# EAGLE design ashield (EAGLE 5.11)
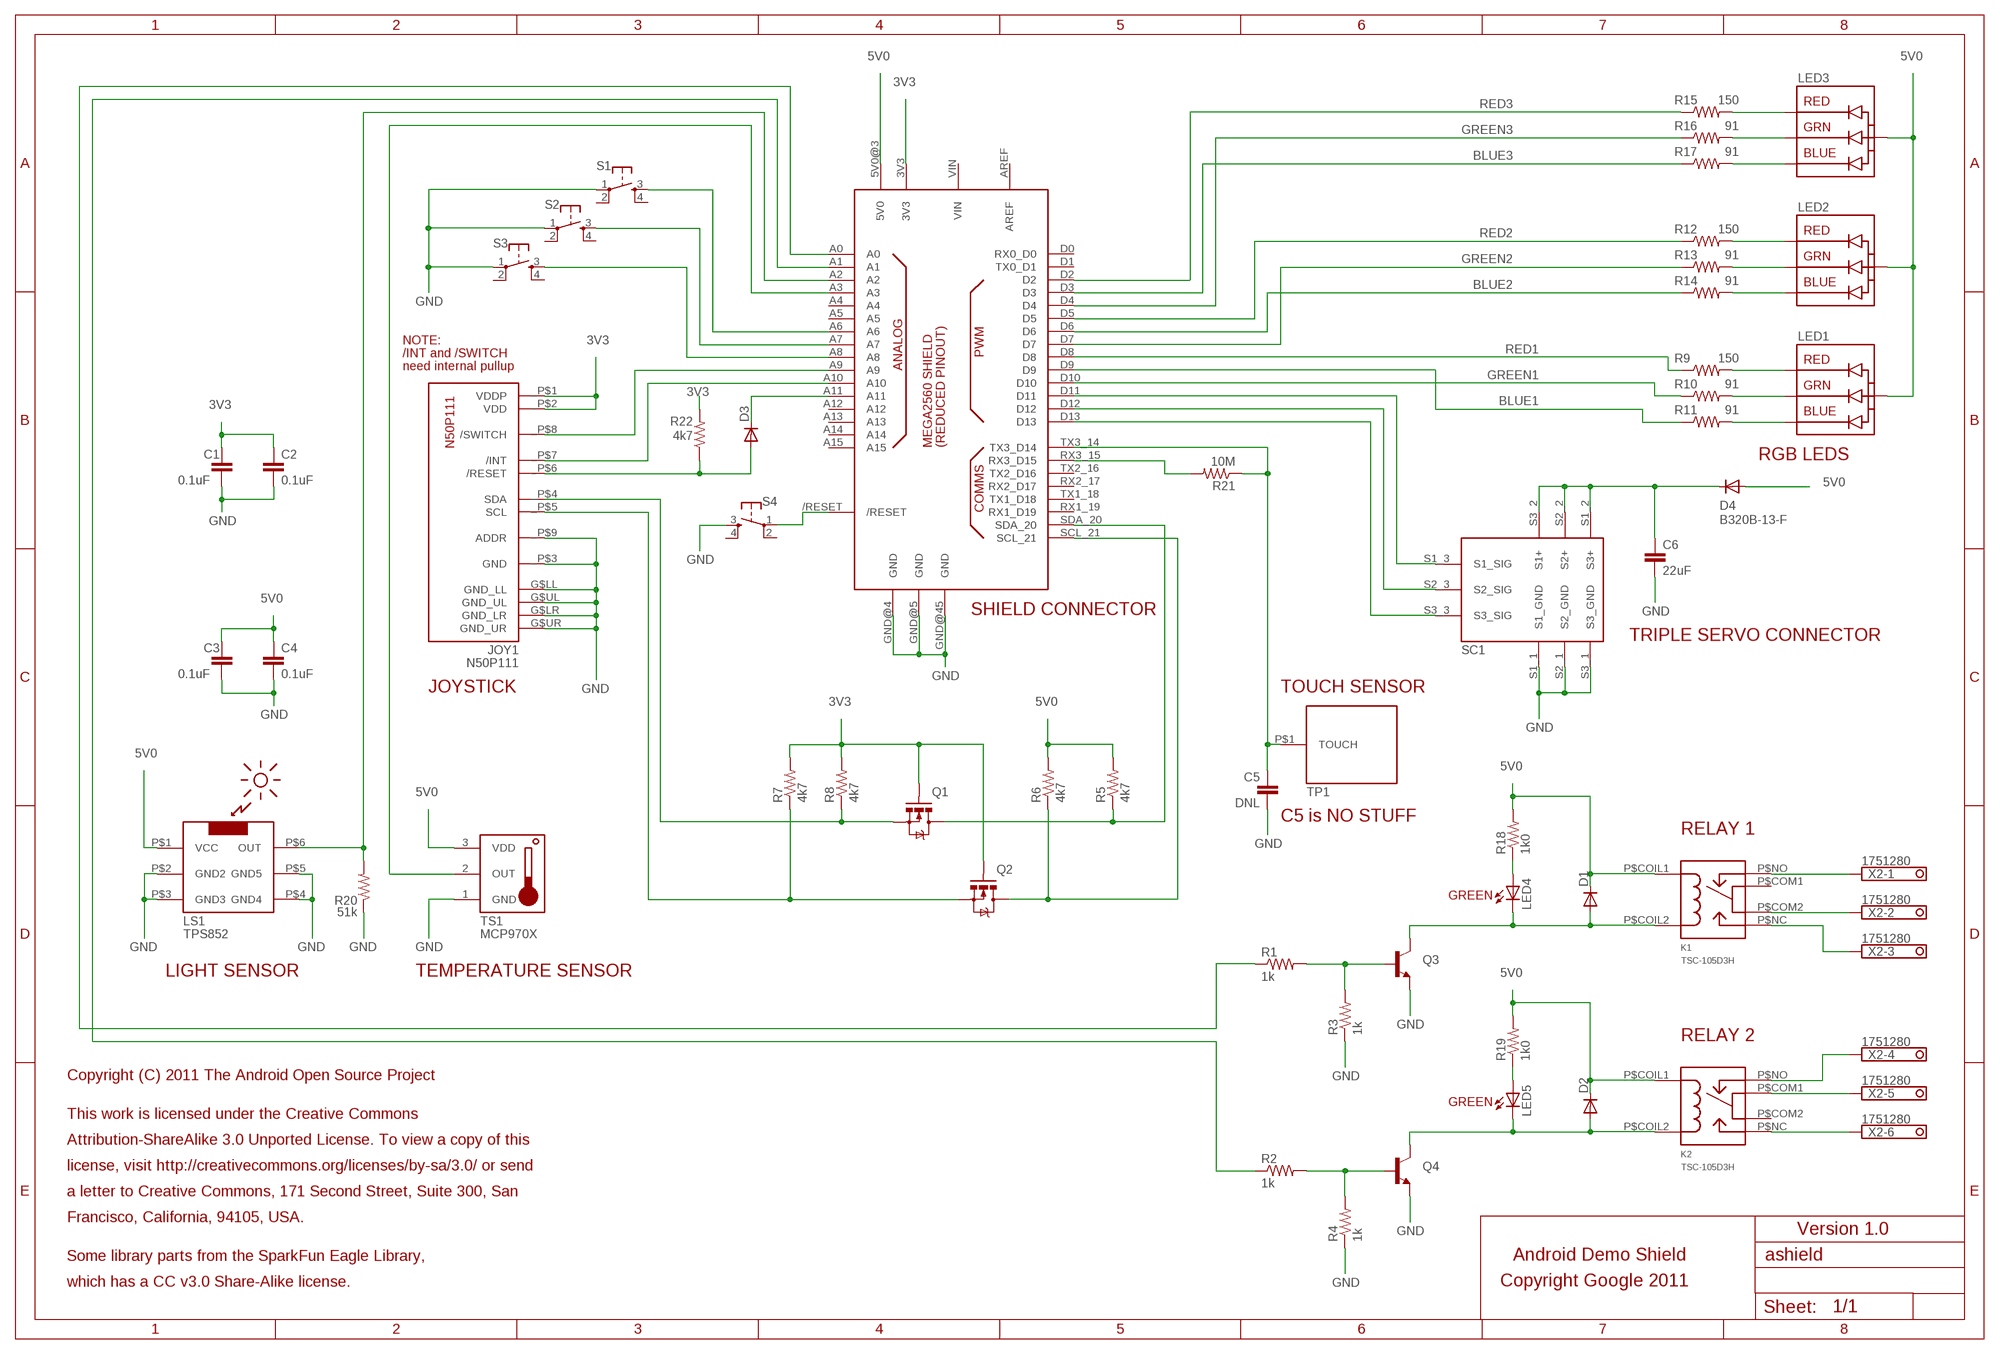
[diagram p0: schematic, sheet 1]

## Parts
BOARD1  MEGAARDUINO_REDUCED  [MEGA_ARDUINO_REDUCED]
C1  0.1uF  CAP0603-CAP  [0603-CAP]
C2  0.1uF  CAP0603-CAP  [0603-CAP]
C3  0.1uF  CAP0603-CAP  [0603-CAP]
C4  0.1uF  CAP0603-CAP  [0603-CAP]
C5  DNL  CAP0603-CAP  [0603-CAP]
C6  22uF  CAP1206  [1206]
D1  DIODESOD  [SOD-323]
D2  DIODESOD  [SOD-323]
D3  DIODESOD  [SOD-323]
D4  B320B-13-F  DIODESMA  [SMA-DIODE]
JOY1  N50P111  [N50P111]
K1  TSC-105D3H  [TSC-105D3H]
K2  TSC-105D3H  [TSC-105D3H]
LED1  SMD_RGB_LED4  [4SMD_LED]
LED2  SMD_RGB_LED4  [4SMD_LED]
LED3  SMD_RGB_LED4  [4SMD_LED]
LED4  LEDCHIPLED_0603  [CHIPLED_0603]
LED5  LEDCHIPLED_0603  [CHIPLED_0603]
LS1  TPS852  [TPS852]
Q1  MOSFET-NCHANNELSMD  [SOT23-3]
Q2  MOSFET-NCHANNELSMD  [SOT23-3]
Q3  TRANSISTOR_NPNSOT23-3  [SOT23-3]
Q4  TRANSISTOR_NPNSOT23-3  [SOT23-3]
R1  1k  RESISTOR0402-RES  [0402-RES]
R2  1k  RESISTOR0402-RES  [0402-RES]
R3  1k  RESISTOR0402-RES  [0402-RES]
R4  1k  RESISTOR0402-RES  [0402-RES]
R5  4k7  RESISTOR0402-RES  [0402-RES]
R6  4k7  RESISTOR0402-RES  [0402-RES]
R7  4k7  RESISTOR0402-RES  [0402-RES]
R8  4k7  RESISTOR0402-RES  [0402-RES]
R9  150  RESISTOR0402-RES  [0402-RES]
R10  91  RESISTOR0402-RES  [0402-RES]
R11  91  RESISTOR0402-RES  [0402-RES]
R12  150  RESISTOR0402-RES  [0402-RES]
R13  91  RESISTOR0402-RES  [0402-RES]
R14  91  RESISTOR0402-RES  [0402-RES]
R15  150  RESISTOR0402-RES  [0402-RES]
R16  91  RESISTOR0402-RES  [0402-RES]
R17  91  RESISTOR0402-RES  [0402-RES]
R18  1k0  RESISTOR0402-RES  [0402-RES]
R19  1k0  RESISTOR0402-RES  [0402-RES]
R20  51k  RESISTOR0402-RES  [0402-RES]
R21  10M  RESISTOR0402-RES  [0402-RES]
R22  4k7  RESISTOR0402-RES  [0402-RES]
S1  B3S-1000  [B3S-10XX]
S2  B3S-1000  [B3S-10XX]
S3  B3S-1000  [B3S-10XX]
S4  B3S-1000  [B3S-10XX]
SC1  3SERVOS  [3SERVOS]
TP1  ROBOT_TOUCHPADBARE  [ROBOT_50_TP_BARE]
TS1  MCP970X  [TO92]
X2  1751280  [1751280]

## Nets
3V3: BOARD1.3V3 C1.1 C2.1 JOY1._P$1(VDDP) JOY1._P$2(VDD) Q1.1(G) Q2.1(G) R7.2 R8.2 R22.2
5V0: BOARD1.5V0@3(5V0) C3.1 C4.1 D1.1(C) D2.1(C) D4.A K1.P$COIL1(COIL1) K2.P$COIL1(COIL1) LED1.P$2_CA(CA) LED2.P$2_CA(CA) LED3.P$2_CA(CA) LS1.P$1(VCC) R5.2 R6.2 R18.2 R19.2 TS1.3(VDD)
/JOYINT: BOARD1.A10 JOY1._P$7(/INT)
/JOYSWITCH: BOARD1.A9 JOY1._P$8(/SWITCH)
BLUE1: BOARD1.D9 R11.1
BLUE2: BOARD1.D6 R14.1
BLUE3: BOARD1.D3 R17.1
GND: BOARD1.GND@4(GND) BOARD1.GND@5(GND) BOARD1.GND@45(GND) C1.2 C2.2 C3.2 C4.2 C5.2 C6.2 JOY1._P$3(GND) JOY1._P$9(ADDR) JOY1.G$LL(GND_LL) JOY1.G$LR(GND_LR) JOY1.G$UL(GND_UL) JOY1.G$UR(GND_UR) LS1.P$2(GND2) LS1.P$3(GND3) LS1.P$4(GND4) LS1.P$5(GND5) Q3.2(E) Q4.2(E) R3.1 R4.1 R20.1 S1.1(P) S2.1(P) S3.1(P) S4.3(S) SC1.S1_1(S1_GND) SC1.S2_1(S2_GND) SC1.S3_1(S3_GND) TS1.1(GND)
GREEN1: BOARD1.D10 R10.1
GREEN2: BOARD1.D7 R13.1
GREEN3: BOARD1.D4 R16.1
K1_COM: K1.P$COM2(COM2) X2.2
K2_COM: K2.P$COM1(COM1) X2.5
LIGHT_VOLT: BOARD1.A2 LS1.P$6(OUT) R20.2
N$1: BOARD1./RESET S4.1(P)
N$2: LED3.P$3_BLUEK(BLUEK) R17.2
N$3: LED3.P$4_GREENK(GREENK) R16.2
N$4: LED3.P$1_REDK(REDK) R15.2
N$5: LED2.P$3_BLUEK(BLUEK) R14.2
N$6: LED2.P$4_GREENK(GREENK) R13.2
N$7: LED2.P$1_REDK(REDK) R12.2
N$8: LED1.P$1_REDK(REDK) R9.2
N$9: LED1.P$4_GREENK(GREENK) R10.2
N$10: LED1.P$3_BLUEK(BLUEK) R11.2
N$11: BOARD1.A6 S1.3(S)
N$12: BOARD1.A7 S2.3(S)
N$13: BOARD1.A8 S3.3(S)
N$14: BOARD1.RX3_15(RX3_D15) R21.2
N$15: D1.2(A) K1.P$COIL2(COIL2) LED4.C Q3.3(C)
N$16: D2.2(A) K2.P$COIL2(COIL2) LED5.C Q4.3(C)
N$17: BOARD1.TX3_14(TX3_D14) C5.1 R21.1 TP1.P$1(TOUCH)
N$18: C6.1 D4.C SC1.S1_2(S3+) SC1.S2_2(S2+) SC1.S3_2(S1+)
N$19: D3.2(A) JOY1._P$6(/RESET) R22.1
N$20: BOARD1.A11 D3.1(C)
N$21: K1.P$NO(NO) X2.1
N$22: K1.P$NC(NC) X2.3
N$23: K2.P$NC(NC) X2.6
N$24: K2.P$NO(NO) X2.4
N$25: Q3.1(B) R1.2 R3.2
N$26: Q4.1(B) R2.2 R4.2
N$29: LED4.A R18.1
N$30: LED5.A R19.1
RED1: BOARD1.D8 R9.1
RED2: BOARD1.D5 R12.1
RED3: BOARD1.D2 R15.1
RELAY1: BOARD1.A0 R1.1
RELAY2: BOARD1.A1 R2.1
SCL_3V3: JOY1._P$5(SCL) Q2.2(S) R7.1
SCL_5V: BOARD1.SCL_21 Q2.3(D) R6.1
SDA_3V3: JOY1._P$4(SDA) Q1.2(S) R8.1
SDA_5V: BOARD1.SDA_20 Q1.3(D) R5.1
SERVO1: BOARD1.D11 SC1.S1_3(S1_SIG)
SERVO2: BOARD1.D12 SC1.S2_3(S2_SIG)
SERVO3: BOARD1.D13 SC1.S3_3(S3_SIG)
TEMP_1WIRE: BOARD1.A3 TS1.2(OUT)
Unconnected: BOARD1.A4 BOARD1.A5 BOARD1.A12 BOARD1.A13 BOARD1.A14 BOARD1.A15 BOARD1.D0(RX0_D0) BOARD1.D1(TX0_D1) BOARD1.RX1_19(RX1_D19) BOARD1.RX2_17(RX2_D17) BOARD1.TX1_18(TX1_D18) BOARD1.TX2_16(TX2_D16) K1.P$COM1(COM1) K2.P$COM2(COM2) S1.2(P1) S1.4(S1) S2.2(P1) S2.4(S1) S3.2(P1) S3.4(S1) S4.2(P1) S4.4(S1)

## Notes on the sheet
- NOTE:
- /INT and /SWITCH
- need internal pullup
- RGB LEDS
- SHIELD CONNECTOR
- TRIPLE SERVO CONNECTOR
- JOYSTICK | TOUCH SENSOR
- C5 is NO STUFF
- RELAY 1
- GREEN
- LIGHT SENSOR | TEMPERATURE SENSOR
- RELAY 2
- Copyright (C) 2011 The Android Open Source Project
- GREEN
- This work is licensed under the Creative Commons
- Attribution-ShareAlike 3.0 Unported License. To view a copy of this
- license, visit http://creativecommons.org/licenses/by-sa/3.0/ or send
- a letter to Creative Commons, 171 Second Street, Suite 300, San
- Francisco, California, 94105, USA.
- Version 1.0
- Some library parts from the SparkFun Eagle Library, | Android Demo Shield
- which has a CC v3.0 Share-Alike license. | Copyright Google 2011

## Power pins joined to a net without a drawn wire
AREF: BOARD1.AREF
VIN: BOARD1.VIN

## Library data of the parts
BOARD1 = arduino:MEGAARDUINO_REDUCED
C1-C6 = SparkFun:CAP: Capacitor Standard 0603 ceramic capacitor, and 0.1" leaded capacitor.
D1-D4 = SparkFun:DIODE: Diode These are standard reverse protection diodes and small signal diodes. SMA package can handle up to about 1A. SOD-323 can handle about 200mA. What the SOD-323 package when ordering, there are some mfgs out there that are 5-pin packages.
JOY1 = AustriaMicro:N50P111
K1 K2 = Relay_Type:TSC-105D3H
LED1-LED3 = led-smd:SMD_RGB_LED4
LED4 LED5 = led:LED: LED OSRAM: - CHIPLED LG R971, LG N971, LY N971, LG Q971, LY Q971, LO R971, LY R971 LH N974, LH R974 LS Q976, LO Q976, LY Q976 LO Q996 - Hyper CHIPLED LW Q18S LB Q993, LB Q99A, LB R99A - SideLED LS A670, LO A670, LY A670, LG A670, LP A670 LB A673, LV A673, LT A673, LW A673 LH A674 LY A675 LS A676, LA A676, LO A676, LY A676, LW A676 LS A679, LY A679, LG A679 - Hyper Micro SIDELED® LS Y876, LA Y876, LO Y876, LY Y876 LT Y87S - SmartLED LW L88C, LW L88S LB L89C, LB L89S, LG L890 LS L89K, LO L89K, LY L89K LS L896, LA L896, LO L896, LY L896 - TOPLED LS T670, LO T670, LY T670, LG T670, LP T670 LSG T670, LSP T670, LSY T670, LOP T670, LYG T670 LG T671, LOG T671, LSG T671 LB T673, LV T673, LT T673, LW T673 LH T674 LS T676, LA T676, LO T676, LY T676, LB T676, LH T676, LSB T676, LW T676 LB T67C, LV T67C, LT T67C, LS T67K, LO T67K, LY T67K, LW E67C LS E67B, LA E67B, LO E67B, LY E67B, LB E67C, LV E67C, LT E67C LW T67C LS T679, LY T679, LG T679 LS T770, LO T770, LY T770, LG T770, LP T770 LB T773, LV T773, LT T773, LW T773 LH T774 LS E675, LA E675, LY E675, LS T675 LS T776, LA T776, LO T776, LY T776, LB T776 LHGB T686 LT T68C, LB T68C - Hyper Mini TOPLED® LB M676 - Mini TOPLED Santana® LG M470 LS M47K, LO M47K, LY M47K Source: http://www.osram.convergy.de LUXEON: - LUMILED® LXK2-PW12-R00, LXK2-PW12-S00, LXK2-PW14-U00, LXK2-PW14-V00 LXK2-PM12-R00, LXK2-PM12-S00, LXK2-PM14-U00 LXK2-PE12-Q00, LXK2-PE12-R00, LXK2-PE12-S00, LXK2-PE14-T00, LXK2-PE14-U00 LXK2-PB12-K00, LXK2-PB12-L00, LXK2-PB12-M00, LXK2-PB14-N00, LXK2-PB14-P00, LXK2-PB14-Q00 LXK2-PR12-L00, LXK2-PR12-M00, LXK2-PR14-Q00, LXK2-PR14-R00 LXK2-PD12-Q00, LXK2-PD12-R00, LXK2-PD12-S00 LXK2-PH12-R00, LXK2-PH12-S00 LXK2-PL12-P00, LXK2-PL12-Q00, LXK2-PL12-R00 Source: www.luxeon.com KINGBRIGHT: KA-3528ASYC Source: www.kingbright.com
LS1 = toshiba_light_sensor:TPS852
Q1 Q2 = SparkFun:MOSFET-NCHANNEL
Q3 Q4 = SparkFun:TRANSISTOR_NPN: Transistor NPN BJT configuration in SOT23 package. MMBT2222 is the common NPN we use. Double check BCE configuration again layout.
R1-R22 = SparkFun:RESISTOR: Resistor Basic schematic elements and footprints for 0603, 1206, and PTH 1/10th watt (small) resistors.
S1-S4 = switch-omron:B3S-1000: Omron Surface Mount Switch, 160g operating force, 4.3mm actuator height, sealed for immersion cleaning
SC1 = servocon:3SERVOS
TP1 = logos:ROBOT_TOUCHPAD
TS1 = microchip_temp:MCP970X
X2 = con-phoenix-350:1751280: MKDS 1/ 6-3,5 Printklemme Nennstrom: 10 A Bemessungsspannung: 160 V Raster: 3,5 mm Polzahl: 6 Montageart: Löten Anschlussart: Schraubanschluss Anschlussrichtung vom Leiter zur Platine: 0° Source: http://eshop.phoenixcontact.com .. 1751280.pdf; MPN: 1751280; OC_FARNELL: unknown; OC_NEWARK: 27R1765

## Board
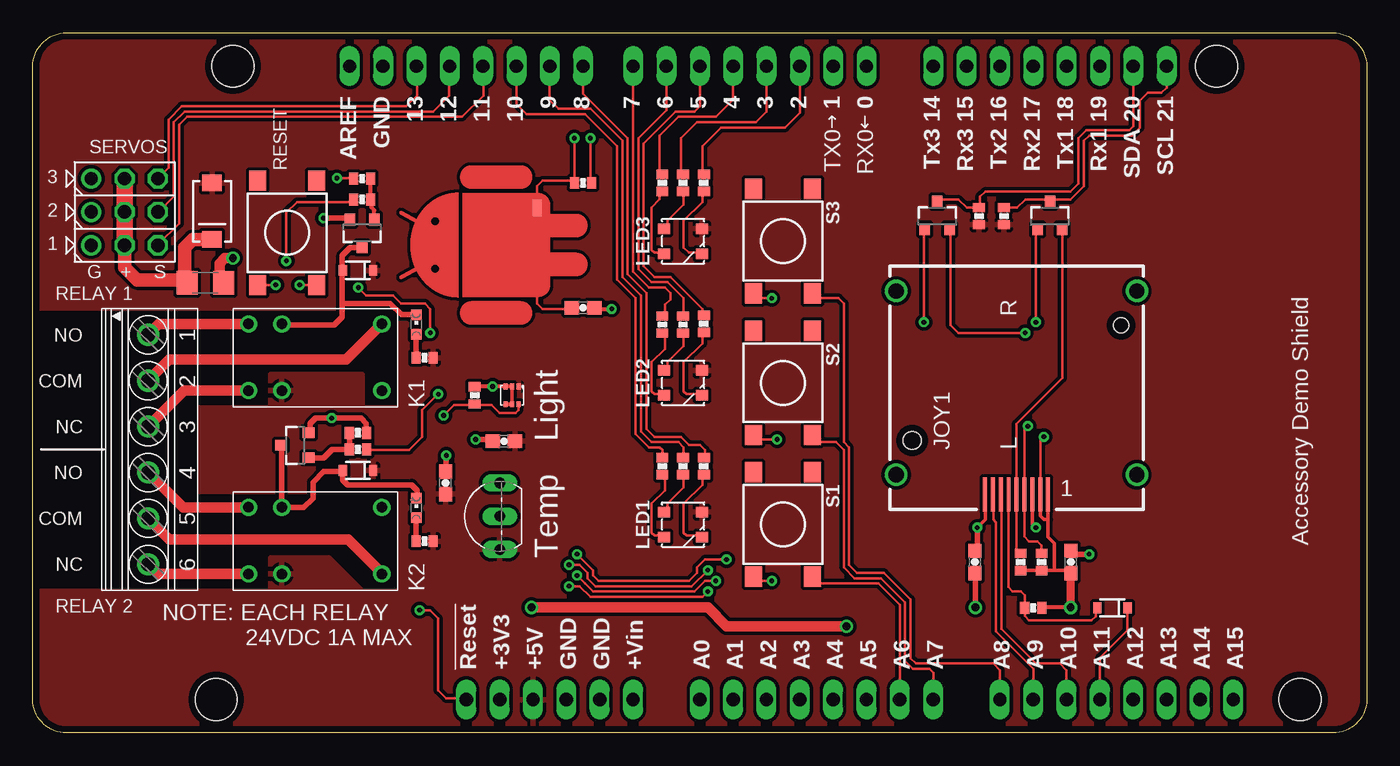
[diagram p1: board, top side]
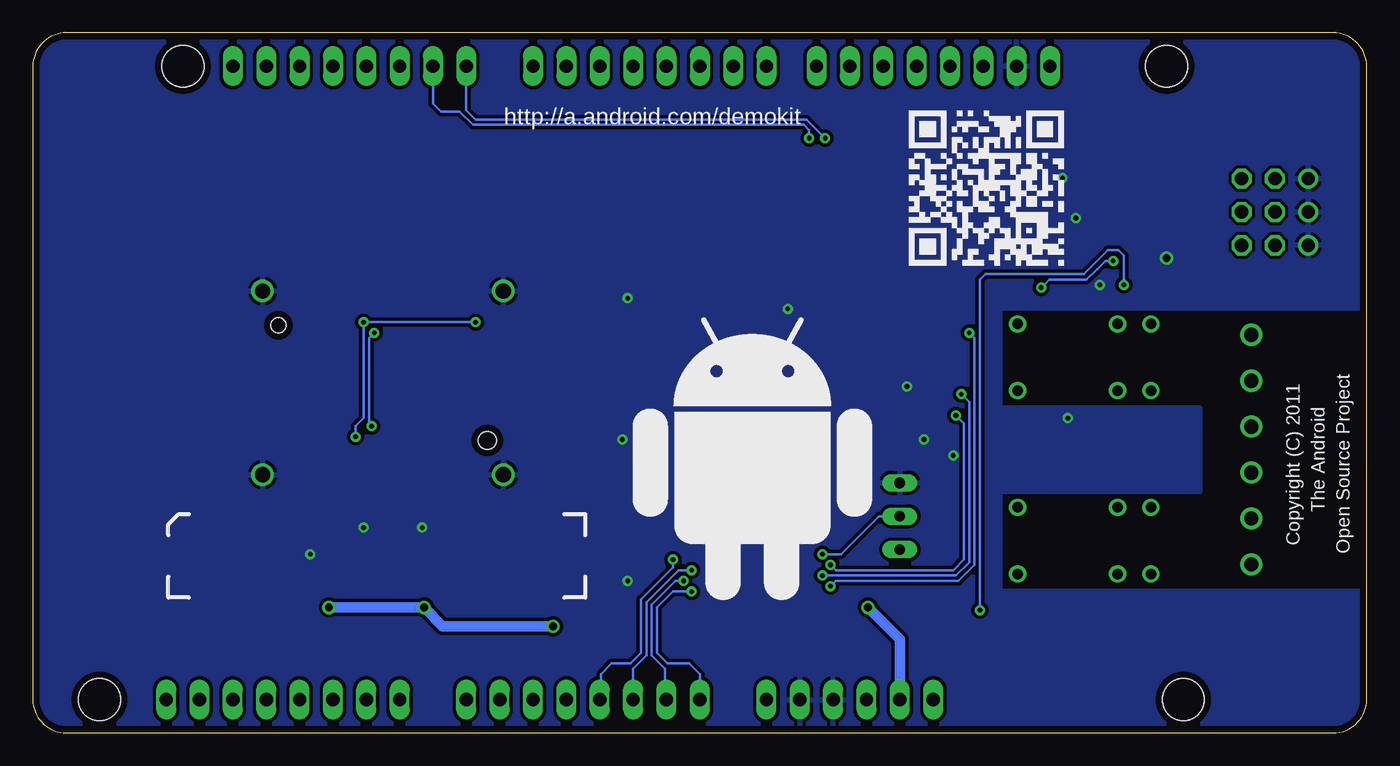
[diagram p2: board, bottom side, seen from below]

Size 101.6 x 53.34 mm. Coordinates in mm from the lower left corner, seen from the top.
Copper layers (1*16): Top 0.035mm / dielectric 1.5mm / Bottom 0.035mm
Design rules "default *": minimum track width 8mil, minimum drill 14mil, track to track 8mil, track to pad 8mil, pad to pad 8mil, via to via 8mil, smd to smd 8mil, copper to edge 20mil, drill to drill 8mil, minimum pad ring 10mil, minimum via ring 8mil, stop-mask expansion 4mil, vias tented up to drill 24mil, thermal gap 10mil

### Footprints (pad centres in the part's own frame; a part is rotated, then mirrored left to right if it is on the bottom)
MEGA_ARDUINO_REDUCED = drill 1.016 long: 3V3 35.56,2.54; 5V0@3 38.1,2.54; /RESET 33.02,2.54; A0 50.8,2.54; A1 53.34,2.54; A2 55.88,2.54; A3 58.42,2.54; A4 60.96,2.54; A5 63.5,2.54; A6 66.04,2.54; A7 68.58,2.54; A8 73.66,2.54; A9 76.2,2.54; A10 78.74,2.54; A11 81.28,2.54; A12 83.82,2.54; A13 86.36,2.54; A14 88.9,2.54; A15 91.44,2.54; AREF 24.13,50.8; D0 63.5,50.8; D1 60.96,50.8; D2 58.42,50.8; D3 55.88,50.8; D4 53.34,50.8; D5 50.8,50.8; D6 48.26,50.8; D7 45.72,50.8; D8 41.91,50.8; D9 39.37,50.8; D10 36.83,50.8; D11 34.29,50.8; D12 31.75,50.8; D13 29.21,50.8; GND@4 40.64,2.54; GND@5 43.18,2.54; GND@45 26.67,50.8; RX1_19 81.28,50.8; RX2_17 76.2,50.8; RX3_15 71.12,50.8; SCL_21 86.36,50.8; SDA_20 83.82,50.8; TX1_18 78.74,50.8; TX2_16 73.66,50.8; TX3_14 68.58,50.8; VIN 45.72,2.54 | hole 3.2: 15.24,50.8; 13.97,2.54; 90.17,50.8; 96.52,2.54
0603-CAP = smd 1.1 x 1: 1 -0.85,0; 2 0.85,0
1206 = smd 1.6 x 1.8: 1 -1.4,0; 2 1.4,0
SOD-323 = smd 0.63 x 0.83: 1 -1.15,0; 2 1.15,0
SMA-DIODE = smd 1.27 x 1.47: A -2.15,0; C 2.15,0
N50P111 = smd 0.3 x 2.6: _P$1 2.4,-8.5; _P$2 1.8,-8.5; _P$3 1.2,-8.5; _P$4 0.6,-8.5; _P$5 0,-8.5; _P$6 -0.6,-8.5; _P$7 -1.2,-8.5; _P$8 -1.8,-8.5; _P$9 -2.4,-8.5 | drill 1.15 round: G$LL 9.17,-7; G$LR 9.17,7; G$UL -9.17,-7; G$UR -9.17,7 | hole 1.15: 7.95,4.4 | hole 1.35: -7.95,-4.4
TSC-105D3H = drill 0.8 round: P$COIL1 -2.5,2.62; P$COIL2 2.58,2.62; P$COM1 -2.5,-5; P$COM2 2.58,-5; P$NC -2.5,5.16; P$NO 2.58,5.16
4SMD_LED = smd 0.8 x 0.9: P$1_REDK -0.95,-1.45; P$2_CA 0.95,-1.45; P$3_BLUEK 0.95,1.45; P$4_GREENK -0.95,1.45
CHIPLED_0603 = smd 0.8 x 0.8: A 0,-0.75; C 0,0.75
TPS852 = smd 0.3 x 0.45: P$1 -0.5,-0.675; P$2 0,-0.675; P$3 0.5,-0.675; P$4 0.5,0.675; P$5 0,0.675; P$6 -0.5,0.675
SOT23-3 = smd 0.8 x 0.9: 1 -0.95,-1; 2 0.95,-1; 3 0,1.1
0402-RES = smd 0.7 x 0.9: 1 -0.65,0; 2 0.65,0
B3S-10XX = smd 1.55 x 1.3: 1 3.975,-2.25; 2 -3.975,-2.25; 3 3.975,2.25; 4 -3.975,2.25
3SERVOS = drill 1.016 round: S1_1 -2.54,-2.54; S2_1 -2.54,0; S3_1 -2.54,2.54 | drill 1.016 octagon: S1_2 0,-2.54; S1_3 2.54,-2.54; S2_2 0,0; S2_3 2.54,0; S3_2 0,2.54; S3_3 2.54,2.54
ROBOT_50_TP_BARE = smd 1.27 x 0.635: P$1 8.89,3.81
TO92 = drill 0.813 long: 1 2.54,0; 2 0,0; 3 -2.54,0
1751280 = drill 1.1 pad 1.7 round: 1 -8.75,-0.1; 2 -5.25,-0.1; 3 -1.75,-0.1; 4 1.75,-0.1; 5 5.25,-0.1; 6 8.75,-0.1

### Placement (x,y rotation side)
BOARD1  0,0 0 top
C1  71.75,13.02 90 top
C2  79.06,13.02 90 top
C3  31.43,19.05 90 top
C4  35.88,22.23 180 top
C5  41.91,32.38 0 top
C6  13.14,34.29 0 top
D1  24.77,35.24 180 top
D2  24.77,20 180 top
D3  82.23,9.53 180 top
D4  13.65,39.75 270 top
JOY1  74.93,26.67 0 top
K1  21.59,28.57 90 top
K2  21.59,14.61 90 top
LED1  49.53,15.88 90 top
LED2  49.53,26.67 90 top
LED3  49.53,37.47 90 top
LED4  29.21,31.11 0 top
LED5  29.21,17.14 0 top
LS1  36.51,25.72 180 top
Q1  68.9,39.37 0 top
Q2  77.47,39.37 0 top
Q3  25.08,38.1 180 top
Q4  20,21.91 90 top
R1  25.08,40.64 0 top
R2  24.77,21.59 180 top
R3  25.08,42.23 0 top
R4  24.77,22.86 180 top
R5  72.07,39.37 270 top
R6  73.98,39.37 270 top
R7  75.25,13.02 270 top
R8  76.83,13.02 270 top
R9  51.12,20.32 270 top
R10  47.94,20.32 270 top
R11  49.53,20.32 270 top
R12  51.12,31.17 270 top
R13  47.94,31.11 270 top
R14  49.53,31.11 270 top
R15  51.12,41.91 270 top
R16  47.94,41.91 270 top
R17  49.53,41.91 270 top
R18  29.84,28.57 0 top
R19  29.84,14.61 0 top
R20  33.66,25.72 270 top
R21  41.91,41.91 0 top
R22  76.2,9.53 0 top
S1  57.15,15.88 270 top
S2  57.15,26.67 270 top
S3  57.15,37.47 270 top
S4  19.37,38.1 270 top
SC1  6.99,39.69 0 top
TP1  42.24,31.11 90 top
TS1  35.56,16.51 90 top
U$2  [QR_AAA_FINAL]  35.24,35.24 0 bottom
U$9  [ROBOT_75]  55.88,10.16 0 bottom
X2  8.89,21.59 270 top

### Tracks (layer width: path | path; a pad name or v marks a point on that pad's centre or on a via)
3V3  (via drill 0.36, 0.6)
  Top 0.203: Q1.1 67.87,38.29 v67.87,31.29 | v76.4,31.29 76.4,38.37 Q2.1 | JOY1._P$2 76.73,22.23 v77.01,22.55
  Top 0.254: R7.2 R8.2 77.83,12.37 | 77.83,12.37 78.88,12.37 C2.1 | 77.83,12.37 77.83,14.43 77.33,14.92 77.33,16.26 | 77.33,16.26 JOY1._P$1 | 77.33,16.26 77.01,16.26 76.73,16.54 JOY1._P$2 | Q2.1 76.73,38.16
  Top 0.305: R22.2 76.88,9.55 v79.05,9.55
  Top 0.406: C1.1 71.81,12.12 v71.81,9.55
  Top 0.61: v79.05,9.55 79.06,9.56 C2.1
  Top 0.813: v38,9.55 51.41,9.55 52.83,8.13 v61.98,8.13
  Bottom 0.203: v67.87,31.29 v76.4,31.29 76.4,23.98 77.01,23.37 v77.01,22.55
  Bottom 0.813: BOARD1.3V3 35.56,7.11 v38,9.55 | v61.98,8.13 70.38,8.13 v71.81,9.55 v79.05,9.55
5V0
  pour Top (isolate 0.254): 0,0 0,10.79 18.1,10.79 18.1,13.34 22.54,13.34 25.08,10.79 27.94,10.79 27.94,18.41 12.7,18.41 12.7,24.77 18.1,24.77 18.1,27.3 25.08,27.3 25.08,24.77 27.94,24.77 27.94,32.38 0,32.38 0,53.34 101.6,53.34 101.6,0
/JOYINT
  Top 0.203: JOY1._P$7 73.76,18.14 73.76,7.92 76.4,5.28 78.23,5.28 78.74,4.78 BOARD1.A10
/JOYSWITCH
  Top 0.203: JOY1._P$8 73.15,18.15 73.15,16.26 73.36,16.05 73.36,7.72 76.2,4.88 BOARD1.A9
BLUE1
  Top 0.203: BOARD1.D9 39.37,48.21 40.03,47.55 42.47,47.55 44.91,45.11 44.91,34.75 46.33,33.33 46.33,22.96 47.14,22.15 49.17,22.15 49.58,21.74 49.58,21.11 R11.1
BLUE2
  Top 0.203: BOARD1.D6 48.26,47.45 46.13,45.31 46.13,35.36 47.14,34.34 48.36,34.34 49.58,33.12 49.58,31.5 R14.1
BLUE3
  Top 0.203: BOARD1.D3 55.88,47.35 55.07,46.53 50.6,46.53 49.38,45.31 49.38,42.7 R17.1
GND  (via drill 0.36, 0.6)
  Top 0.203: S3.1 55.27,33.12 v56.29,33.12 | S2.1 55.24,22.35 v56.69,22.35 | S1.1 55.22,11.58 v56.29,11.58 | C5.2 42.84,32.31 | R3.1 24.25,42.27 v23.16,42.27 | v20.32,34.14 20.97,34.14 arc-90 S4.3
  Top 0.254: LS1.P$5 LS1.P$2 | JOY1._P$3 76.13,15.92 v76.4,15.65 | JOY1._P$9 72.54,18.16 72.54,16.26 v71.93,15.65
  Top 0.305: LS1.P$2 LS1.P$3 v35.01,26.39 33.68,26.39 R20.1 | LS1.P$4 LS1.P$5 | 42.84,32.31 v44.09,32.31
  Top 0.406: Q4.2 21.13,22.99 21.13,23.57 21.54,23.98 v22.76,23.98 24.99,23.98 25.4,23.57 25.4,22.88 R4.1 | C1.2 71.93,14.04 v71.93,15.65 | v80.47,13.61 79.06,13.61 C2.2 | C3.2 31.5,19.9 v31.5,21.13 | C4.2 34.9,22.35 v33.73,22.35 | Q3.2 24.08,39.22 v22.15,39.22
  Top 0.61: C6.2 14.22,34.29
  Top 0.813: v15.24,36.17 14.63,36.17 14.22,35.76 14.22,34.29
  pour Bottom (isolate 0.254): 0,0 0,10.79 27.94,10.79 27.94,18.41 12.7,18.41 12.7,24.77 27.94,24.77 27.94,32.38 27.3,32.38 0,32.38 0,53.34 101.6,53.34 101.6,0
GREEN1
  Top 0.203: BOARD1.D10 36.83,47.9 37.59,47.14 42.06,47.14 44.5,44.7 44.5,34.54 45.92,33.12 45.92,22.76 46.94,21.74 47.75,21.74 47.95,21.54 47.96,20.93 R10.1
GREEN2
  Top 0.203: BOARD1.D7 45.72,35.15 46.94,33.93 48.16,33.93 48.56,33.53 48.56,33.03 48.16,32.63 48.16,31.78 R13.1
GREEN3
  Top 0.203: BOARD1.D4 53.34,48.26 52.02,46.94 49.17,46.94 47.75,45.52 47.75,42.57 R16.1
K1_COM
  Top 0.813: X2.2 10.4,28.45 23.88,28.45 K1.P$COM2
K2_COM
  Top 0.813: X2.5 10.4,14.73 24,14.73 26.59,12.14 K2.P$COM1
LIGHT_VOLT  (via drill 0.36)
  Top 0.203: 37.04,24.95 LS1.P$6 36.98,25.01 36.98,24.59 36.78,24.38 35.56,24.38 34.95,24.99 33.73,24.99 R20.2 33.58,24.99 32.11,24.99 v31.29,24.18 | v51.41,12.39 50.19,11.18 42.88,11.18 42.27,11.79 42.27,12.19 41.66,12.8 v40.84,12.8
  Bottom 0.203: v51.41,12.39 52.43,12.39 54.86,9.96 54.86,5.89 55.88,4.88 BOARD1.A2 | v40.84,12.8 40.44,12.39 31.5,12.39 30.68,13.21 30.68,23.57 v31.29,24.18
N$1  (via drill 0.36)
  Top 0.203: v29.46,9.35 30.28,9.35 30.89,8.74 30.89,3.25 31.5,2.64 32.92,2.64 BOARD1./RESET | v18.49,34.14 18.07,34.12 S4.1
  Bottom 0.203: v29.46,9.35 29.46,34.54 29.06,34.95 21.54,34.95 19.71,36.78 18.9,36.78 18.49,36.37 v18.49,34.14
N$2
  Top 0.203: R17.2 49.58,40.99 49.58,40.23 48.36,39.01 48.36,38.54 LED3.P$3_BLUEK
N$3
  Top 0.203: R16.2 47.75,41.05 47.75,40.66 47.14,40.03 47.14,36.78 47.35,36.58 48.02,36.58 LED3.P$4_GREENK
N$4
  Top 0.203: LED3.P$1_REDK 50.84,36.58 49.99,36.58 49.58,36.98 49.58,39.01 51,40.44 51,41.15 R15.2
N$5
  Top 0.203: LED2.P$3_BLUEK 48.36,27.9 48.36,28.25 49.58,29.46 49.58,30.1 R14.2
N$6
  Top 0.203: R13.2 48.16,30.43 48.16,29.26 47.14,28.25 47.14,26.01 47.35,25.81 47.99,25.81 LED2.P$4_GREENK
N$7
  Top 0.203: R12.2 51,30.38 51,29.67 49.58,28.25 49.58,26.01 49.78,25.81 50.89,25.81 LED2.P$1_REDK
N$8
  Top 0.203: R9.2 51,19.33 51,18.9 49.58,17.48 49.58,15.24 49.78,15.04 50.87,15.04 LED1.P$1_REDK
N$9
  Top 0.203: R10.2 48.16,19.45 48.16,18.49 47.14,17.48 47.14,15.24 47.35,15.04 47.99,15.04 LED1.P$4_GREENK
N$10
  Top 0.203: LED1.P$3_BLUEK 48.36,17.11 48.36,17.48 49.58,18.69 49.58,19.62 R11.2
N$11
  Top 0.203: S1.3 59.92,11.38 64.41,11.38 66.04,9.75 BOARD1.A6
N$12
  Top 0.203: S2.3 59.95,22.15 61.16,22.15 61.77,21.54 61.77,12.6 62.59,11.79 64.62,11.79 66.45,9.96 66.45,5.49 67.06,4.88 68.28,4.88 68.58,4.57 BOARD1.A7
N$13
  Top 0.203: S3.3 59.77,33.12 61.37,33.12 61.77,32.72 61.77,22.15 62.18,21.74 62.18,12.8 62.79,12.19 64.82,12.19 66.85,10.16 66.85,5.69 67.26,5.28 73.15,5.28 73.66,4.78 BOARD1.A8
N$14  (via drill 0.36)
  Top 0.203: R21.2 42.47,42 v42.47,45.31
  Bottom 0.203: v42.47,45.31 42.47,45.92 42.88,46.33 68.07,46.33 69.09,47.35 70.51,47.35 71.12,47.95 BOARD1.RX3_15
N$15
  Top 0.406: K1.P$COIL2 19.04,31.09 22.96,31.09 23.57,31.7 23.57,32.72 | LED4.C 28.08,31.86 27.23,32.72 23.57,32.72 | Q3.3 24.93,36.98 24.18,36.98 23.57,36.37 23.57,35.34 D1.2 23.57,35.15 23.57,32.72
N$16
  Top 0.406: Q4.3 18.97,21.84 K2.P$COIL2 20.64,17.18 21.34,17.88 21.34,19.1 22.15,19.91 23.53,19.91 D2.2 23.61,19.26 23.98,18.9 28.85,18.9 29.26,18.49 29.26,17.95 LED5.C
N$17  (via drill 0.36)
  Top 0.203: C5.1 40.98,32.31 38.81,32.31 38.41,32.72 38.41,40.01 TP1.P$1 38.41,40.03 38.41,41.66 38.81,42.06 41.11,42.06 R21.1 v41.26,45.3 v41.25,45.31
  Bottom 0.203: v41.25,45.31 42.67,46.74 67.87,46.74 68.58,47.45 BOARD1.TX3_14
N$18
  Top 1.016: SC1.S2_2 6.99,35.47 7.94,34.52 11.2,34.52 | 11.2,34.52 C6.1 | 11.2,34.52 11.56,34.52 11.58,34.54 11.58,36.98 12.19,37.59 13.33,37.59 D4.C
  Top 1.27: SC1.S3_2 SC1.S2_2 SC1.S1_2
N$19
  Top 0.203: D3.2 80.96,9.4 80.96,8.89 80.64,8.57 75.88,8.57 75.55,8.9 R22.1 75.56,9.54 75.56,10.48 75.25,10.79 74.61,10.79 74.3,11.11 74.3,18.14 JOY1._P$6
N$20
  Top 0.203: BOARD1.A11 81.28,5.71 83.38,7.82 D3.1
N$21
  Top 0.813: K1.P$NO 9.61,31.16 X2.1
N$22
  Top 0.813: K1.P$NC 11.53,26.07 X2.3
N$23
  Top 0.813: K2.P$NC 9.53,12.11 X2.6
N$24
  Top 0.813: K2.P$NO 11.45,17.18 X2.4
N$25
  Top 0.305: Q3.1 26.01,39.19 26.01,39.83 25.8,40.04 25.8,40.43 R1.2 R3.2
N$26
  Top 0.406: R4.2 R2.2 22.81,21.59 22.15,20.93 21.03,20.93 Q4.1
N$29
  Top 0.203: 29.2,30.35 LED4.A
  Top 0.406: R18.1 29.2,30.35
N$30
  Top 0.203: 29.2,16.38 LED5.A
  Top 0.406: R19.1 29.2,16.38
RED1
  Top 0.203: BOARD1.D8 41.91,48.72 45.31,45.31 45.31,34.95 46.74,33.53 46.74,23.16 47.35,22.55 49.38,22.55 49.99,21.95 50.8,21.95 51.21,21.54 51.21,20.83 R9.1
RED2
  Top 0.203: BOARD1.D5 50.8,47.75 50.39,47.35 48.97,47.35 46.53,44.91 46.53,35.56 47.35,34.75 48.56,34.75 51,32.31 51,31.52 R12.1
RED3
  Top 0.203: BOARD1.D2 58.42,47.24 57.3,46.13 52.43,46.13 51,44.7 51,42.67 R15.1
RELAY1  (via drill 0.36)
  Top 0.203: v40.84,11.18 41.66,11.18 42.47,10.36 51,10.36 v51.41,10.77 | v30.28,30.48 30.28,32.31 29.87,32.72 28.04,32.72 27.43,33.33 25.4,33.33 v24.79,33.93 | R1.1 24.29,40.44 20.12,40.44 19.3,39.62 v19.3,35.97
  Bottom 0.203: BOARD1.A0 50.8,4.47 51.61,5.28 53.24,5.28 54.05,6.1 54.05,9.55 52.83,10.77 v51.41,10.77 | v40.84,11.18 40.44,11.58 31.09,11.58 29.87,12.8 29.87,30.07 v30.28,30.48 | v19.3,35.97 19.91,35.97 20.52,35.36 21.34,34.54 24.18,34.54 v24.79,33.93
RELAY2  (via drill 0.36)
  Top 0.203: R2.1 25.47,21.54 28.65,21.54 29.67,22.55 29.67,24.59 v30.89,25.81 | v41.45,11.99 42.06,11.38 42.67,10.77 50.39,10.77 51.21,11.58 v52.02,11.58
  Bottom 0.203: v30.89,25.81 30.28,25.2 30.28,13.01 31.29,11.99 v41.45,11.99 | v52.02,11.58 52.63,11.58 54.46,9.75 54.46,5.89 53.44,4.88 53.44,2.64 BOARD1.A1
SCL_3V3
  Top 0.203: R7.1 74.93,13.98 JOY1._P$5 74.93,23.52 78.44,27.03 78.44,38.35 Q2.2
SCL_5V
  Top 0.203: BOARD1.SCL_21 86.36,49.17 85.95,48.77 84.94,48.77 84.33,48.16 84.33,46.13 83.72,45.52 80.47,45.52 80.06,45.11 80.06,41.66 79.05,40.64 77.64,40.64 Q2.3 77.3,40.64 75.59,40.64 74.97,40.02 R6.1
SDA_3V3  (via drill 0.36)
  Top 0.203: R8.1 76.83,14.29 76.52,14.61 75.88,14.61 75.53,14.96 JOY1._P$4 75.53,23.1 v75.79,23.37 | v75.59,30.48 70.51,30.48 69.9,31.09 69.9,38.32 Q1.2
  Bottom 0.203: v75.79,23.37 76,23.57 76,30.07 v75.59,30.48
SDA_5V
  Top 0.203: Q1.3 69.07,40.64 70.51,40.64 71.13,40.02 R5.1 72.14,40.08 72.14,40.84 72.54,41.25 79.05,41.25 79.65,41.86 79.65,45.31 80.26,45.92 83.52,45.92 83.82,46.23 BOARD1.SDA_20
SERVO1
  Top 0.203: SC1.S1_3 9.53,37.19 11.15,38.81 11.15,46.33 11.76,46.94 32.72,46.94 34.34,48.56 34.34,50.75 BOARD1.D11
SERVO2
  Top 0.203: SC1.S2_3 9.59,39.69 10.74,40.84 10.74,46.53 11.56,47.35 30.48,47.35 31.7,48.56 31.7,50.75 BOARD1.D12
SERVO3
  Top 0.203: BOARD1.D13 29.26,50.75 29.26,48.56 28.45,47.75 11.35,47.75 10.34,46.74 10.34,43.08 9.53,42.27 SC1.S3_3
TEMP_1WIRE  (via drill 0.36)
  Top 0.203: v41.45,13.61 42.67,12.39 42.67,11.99 43.08,11.58 49.99,11.58 50.6,12.19 50.6,12.6 51.21,13.21 v52.83,13.21
  Bottom 0.203: v52.83,13.21 52.83,12.6 55.27,10.16 55.27,6.1 56.08,5.28 57.51,5.28 58.32,4.47 58.32,2.64 BOARD1.A3 | v41.45,13.61 40.03,13.61 37.13,16.51 TS1.2

### Text on the board
Dimension: ASHIELD Board | Release v1.0, March 28, 2011 | Copyright Google, Inc. 2011 | Route 0-mil perimeter in top silk | .062" FR4 | 1 oz Cu | RoHS | HASL | VENDOR MARK AND TEST STAMP SHOULD | NOTE: | BE PLACED WITHIN JOY1 RECTANGLE | OTHER NOTES: | Board is WHITE SMOBC | ashield_blk.plc | BLACK primary (first) layer silk, component side | ashield_blk.pls | BLACK silk, solder side
tPlace: SERVOS | 3 | RESET | 2 | 1 | RELAY 1 | NO | COM | NC | Light | NO | COM | Accessory Demo Shield | NC | Temp | RELAY 2 | NOTE: EACH RELAY | 24VDC 1A MAX
bPlace: http://a.android.com/demokit | The Android | Open Source Project | Copyright (C) 2011
tDocu: J4 | J6 | J5 | R21 | J1 | J2 | J3